# EasyEDA Pro project ProDoc_OHPP_003A_MIDI_B.epro, board OHPP-003-MIDI_B_2
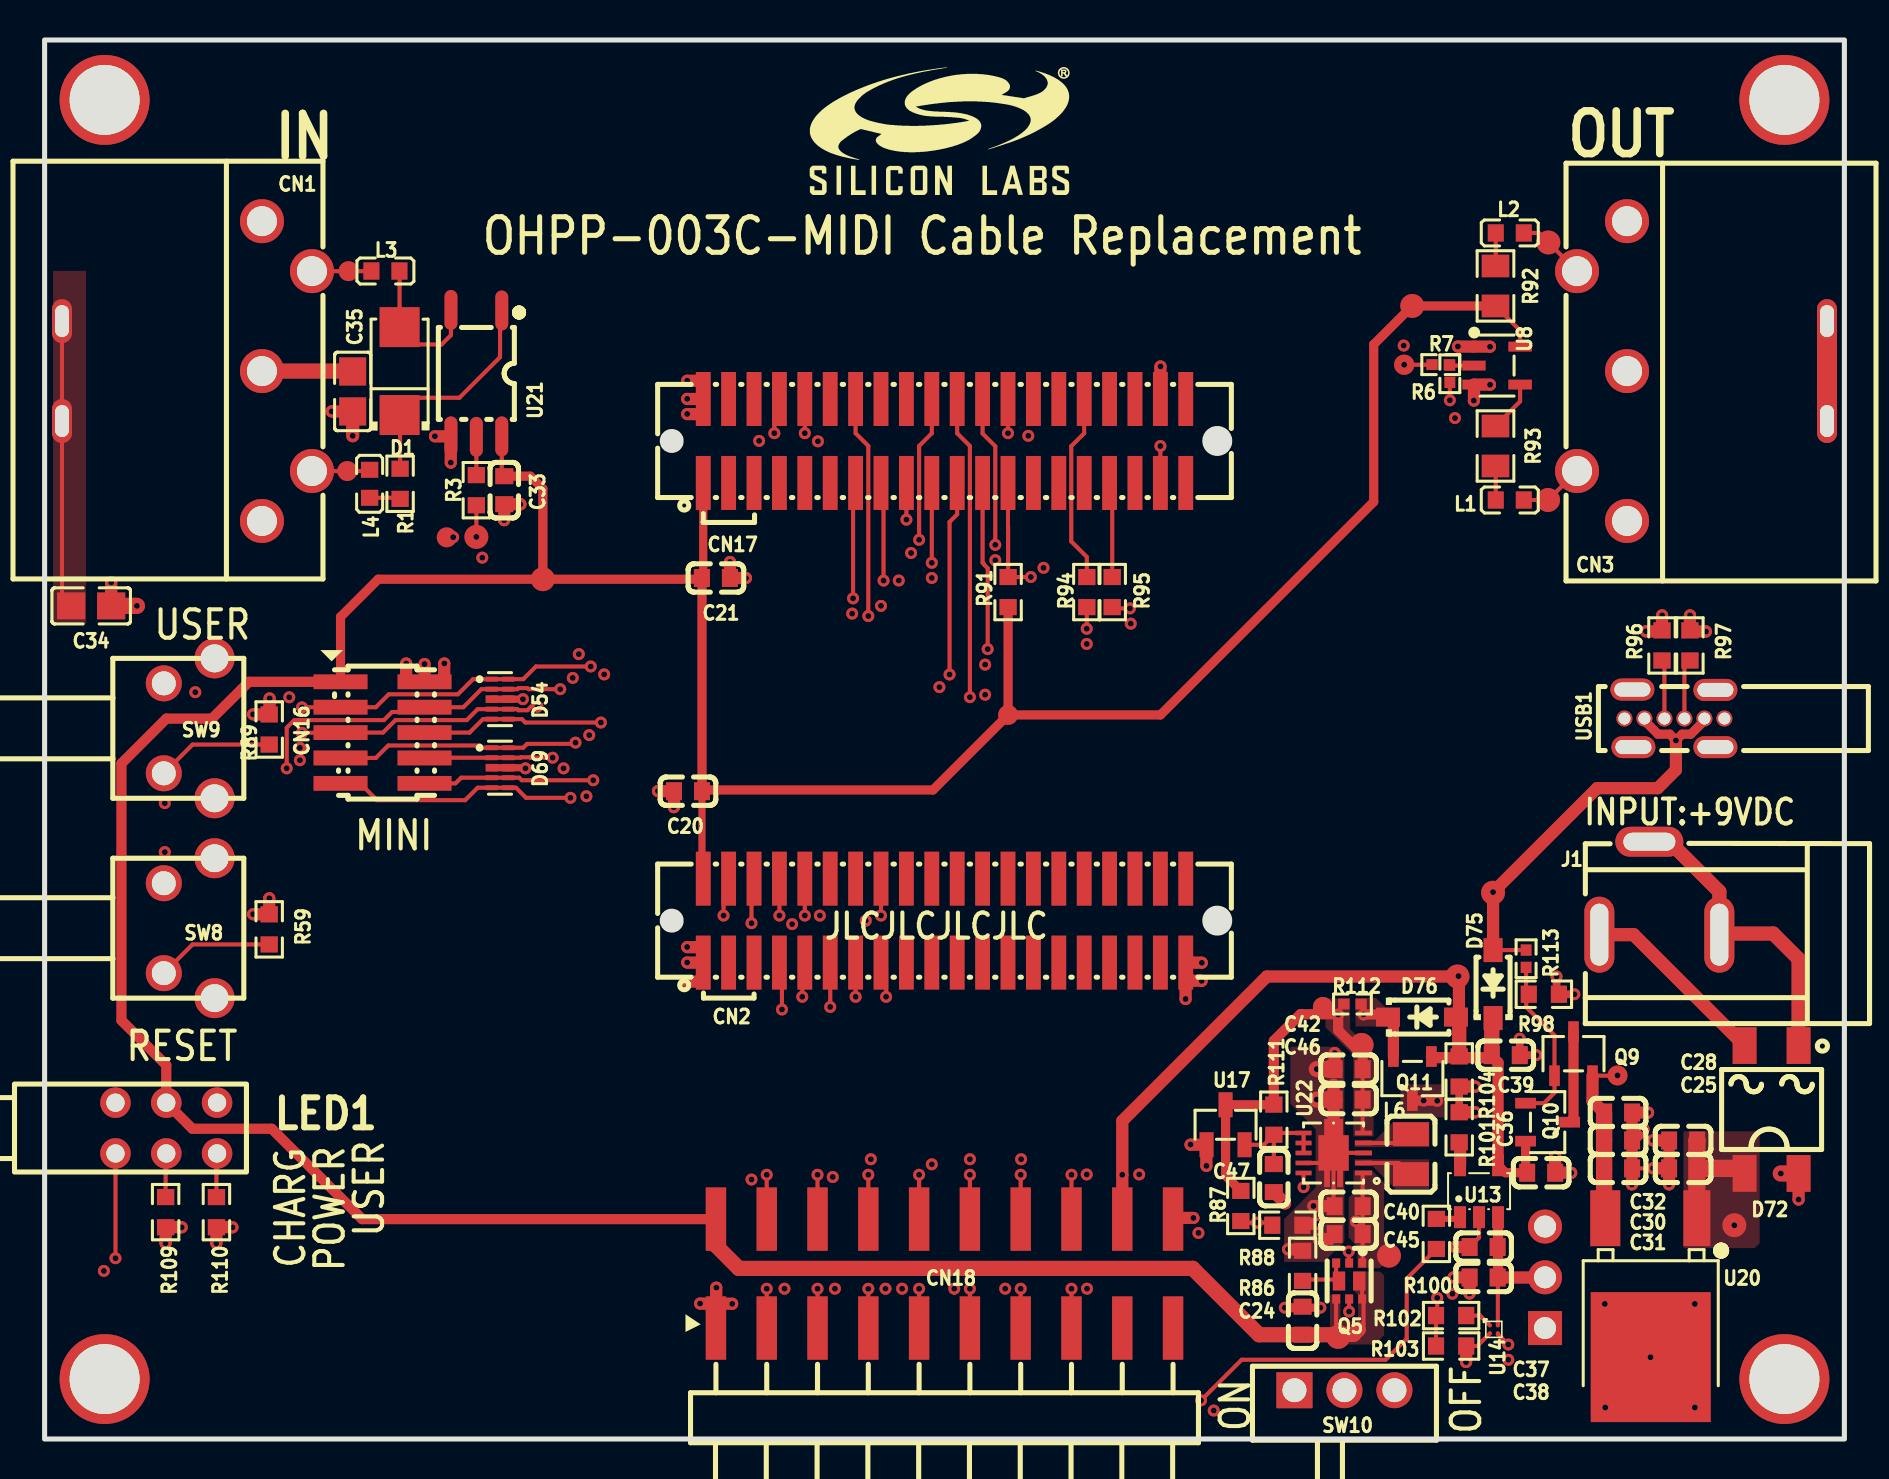
[diagram p2: board, top side]
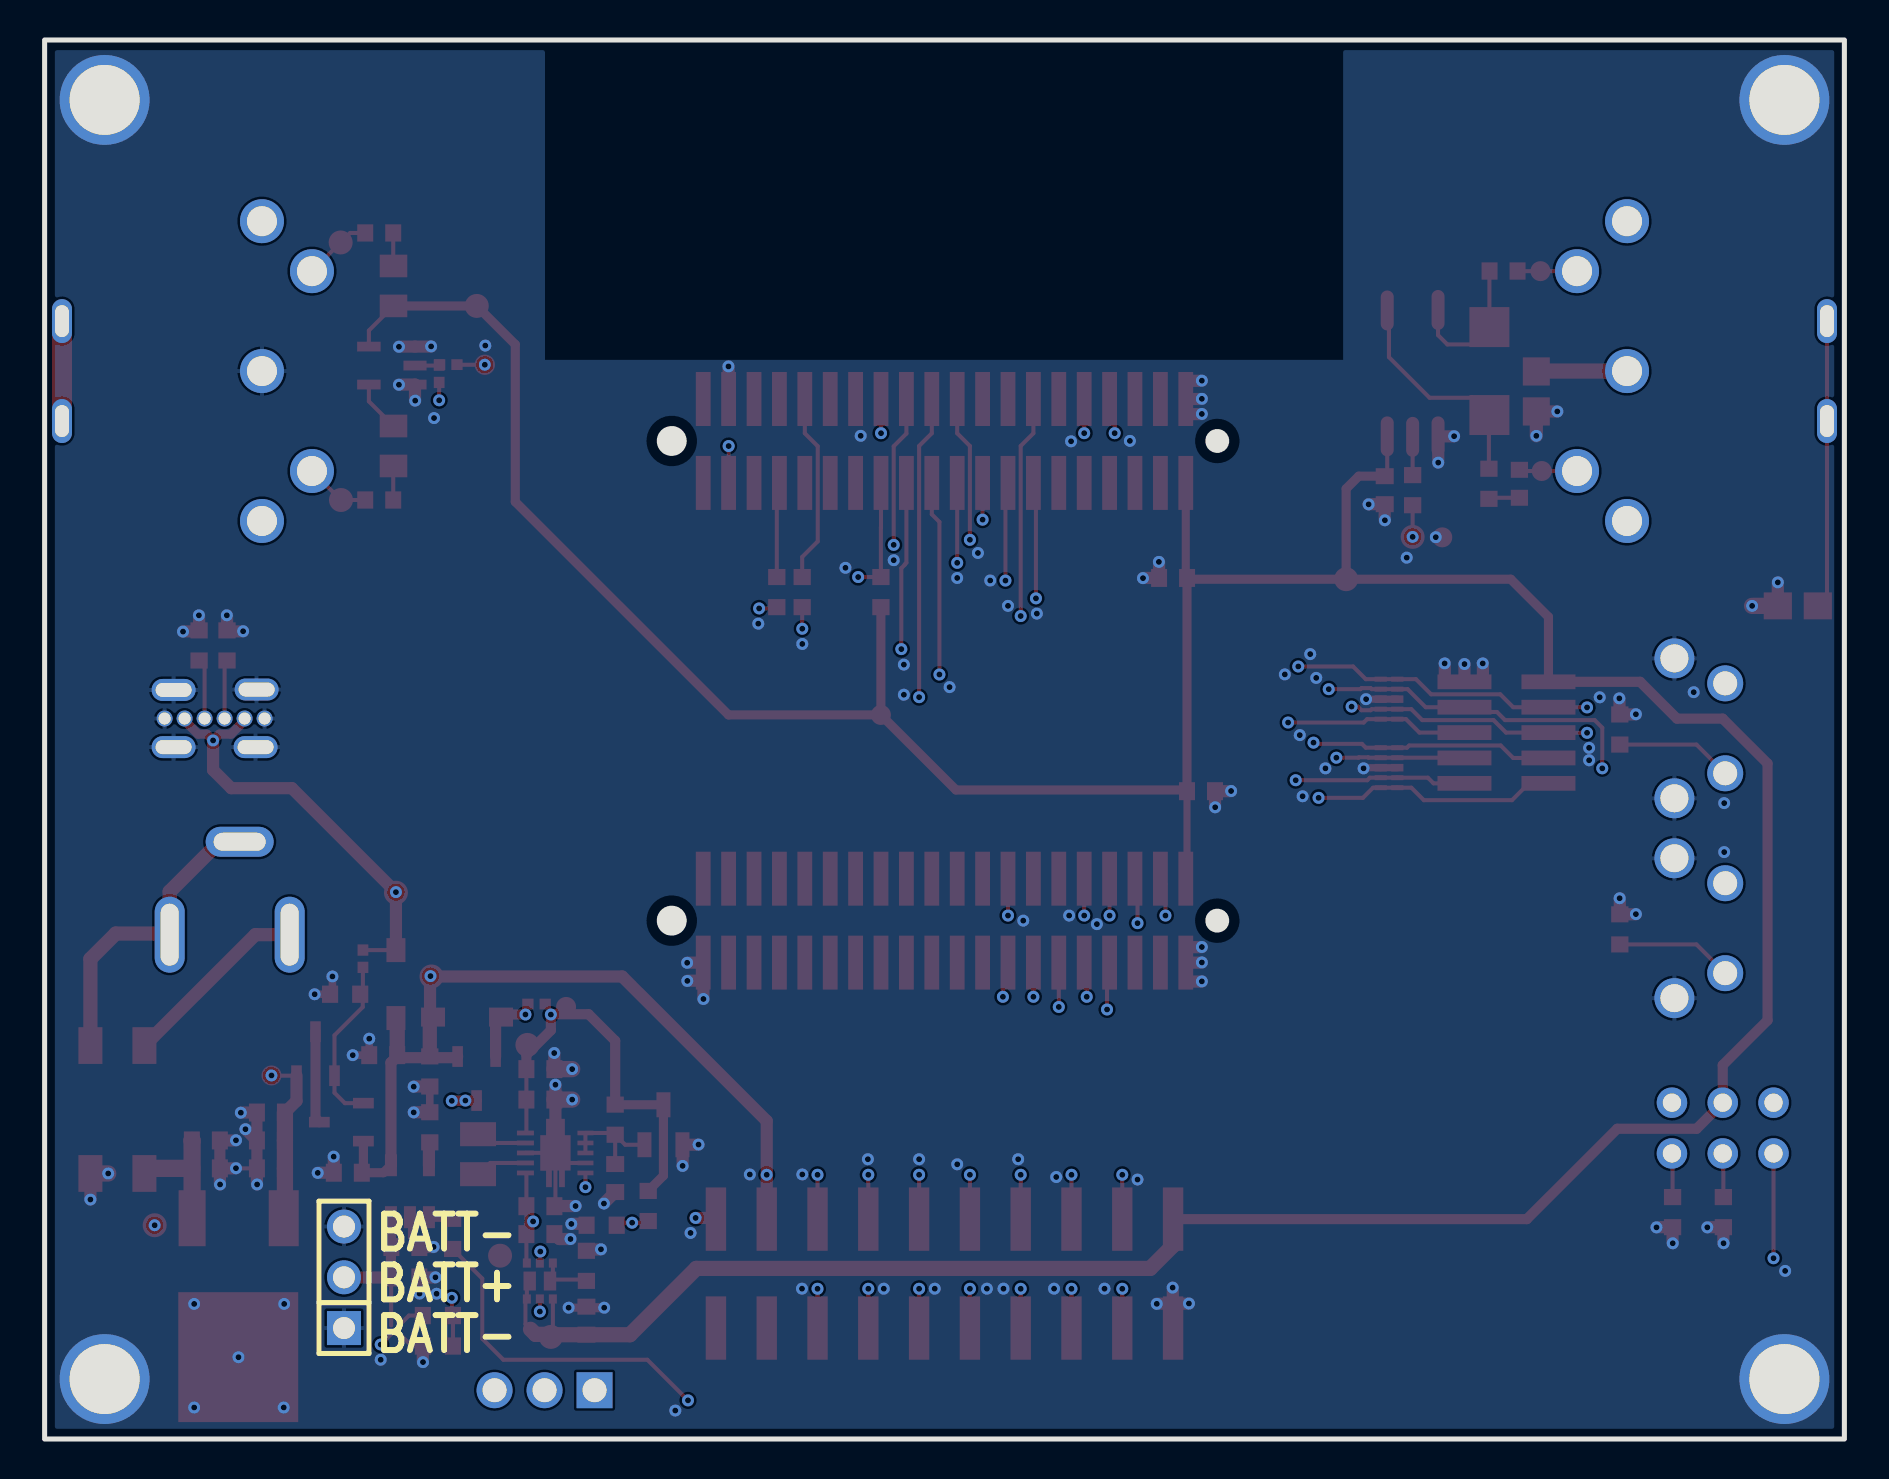
[diagram p3: board, bottom side, seen from below]

Outline 90 x 70 mm; copper layers: Top Layer, Inner1, Inner2, Bottom Layer. Coordinates in mm from the lower left corner of the outline.
Outline path: rectangle 0,70 90,0
Stack: Top Layer 0.035mm Outer layer thickness 1oz / Dielectric1 0.2104mm 7628 RC49% 8.6mil / Inner1 0.0152mm Inner layer thickness / Dielectric2 1.065mm 1.1mm H/HOZ Copper / Inner2 0.0152mm Inner layer thickness / Dielectric3 0.2104mm 7628 RC49% 8.6mil / Bottom Layer 0.035mm Outer layer thickness 1oz

## Design rules (mm)
template: Custom Config
spacing copperThickness1oz (default): track to track 0.102, other pairs 0.127 to 0.508
spacing copperThickness2oz: track to track 0.203, other pairs 0.203 to 0.203
track width copperThickness1oz (default): min 0.203, default 0.203, max 2.54
track width copperThickness2oz: min 0.203, default 0.508, max 2.54
differential pair differentialPair (default): width min 0.127, default 0.254, max 2.54; gap min 0.152, default 0.152
via viaSize (default): diameter min 0.45, default 0.599, max 1.801; hole min 0.201, default 0.3, max 1.001

## Placement (name value [footprint] x y rotation side)
C20  100nF  [C0603]  32.17 32.41 0 top
C21  100nF  [C0603]  33.57 43.08 180 top
C24  1uF  [C0603]  62.91 5.92 270 top
C25  10uF  [C0603]  81.94 13.54 0 top
C28  100nF  [C0603]  81.94 14.94 0 top
C30  10uF  [C0603]  78.68 14.94 180 top
C31  10uF  [C0603]  78.68 13.54 180 top
C32  100nF  [C0603]  78.68 16.34 180 top
C33  100nF  [C0603]  22.99 47.47 90 top
C34  100nF  [C0805]  2.33 41.68 180 top
C35  100nF  [C0805]  15.41 52.41 90 top
C36  10uF  [C0603]  74.84 13.32 180 top
C37  10uF  [C0603]  71.96 9.61 0 top
C38  100nF  [C0603]  71.96 8.08 0 top
C39  100nF  [C0603]  73.07 19.21 180 top
C40  10uF  [C0603]  65.21 11.65 0 top
C42  10uF  [C0603]  65.21 18.51 0 top
C45  10uF  [C0603]  65.21 10.25 0 top
C46  10uF  [C0603]  65.21 16.98 0 top
C47  100nF  [C0603]  61.47 13.06 270 top
CN1  DIN-504D-M5  [CONN-TH_DIN-504D-M5]  7.12 53.43 270 top
CN2  3131-40MG0BK00T2  [CONN-SMD_40P-P1.27_WCON_3131-40MG0BK00T2]  45 25.94 180 top
CN3  DIN-504D-M5  [CONN-TH_DIN-504D-M5]  82.88 53.43 90 top
CN16  3132-10MG0BK00R2  [IDC-SMD_3132-10MG0BK00R2]  16.9 35.35 270 top
CN17  3131-40MG0BK00T2  [CONN-SMD_40P-P1.27_WCON_3131-40MG0BK00T2]  45 49.94 180 top
CN18  PZ254-2-10-WS  [HDR-SMD_20P-P2.54-H-M-R2-C10_L8.5]  45 8.28 0 top
D1  MBRA140T3G  [SMA_L4.3-W2.6-LS5.2-RD]  17.75 53.43 90 top
D54  TPD4E02B04DQAR  [USON-10_L2.5-W1.0-P0.50-BL]  22.77 37.02 270 top
D69  TPD4E02B04DQAR  [USON-10_L2.5-W1.0-P0.50-BL]  22.77 33.59 270 top
D72  KMB24F  [DIO-BG-SMD_MBF-TL]  86.36 16.49 270 top
D75  B5819W SL  [SOD-123_L2.7-W1.6-LS3.7-RD-1]  72.43 22.76 90 top
D76  B5819W SL  [SOD-123_L2.7-W1.6-LS3.7-RD-1]  68.88 21.11 0 top
H4  -  [HOLE_D3M5_D7M0_PAD_PTH]  3 67 0 top
H5  -  [HOLE_D3M5_D7M0_PAD_PTH]  3 3 0 top
H6  -  [HOLE_D3M5_D7M0_PAD_PTH]  87 3 0 top
H7  -  [HOLE_D3M5_D7M0_PAD_PTH]  87 67 0 top
H8  KH-2.54PH180-1X3P-L11.5  [HDR-TH_3P-P2.54-V-M]  75.03 8.09 90 bottom
J1  DC-005-20A  [DC-IN-TH_DC-005-20A]  80.75 27.56 180 top
L1  MMZ1608Y102BTD25  [L0603]  73.27 46.98 180 top
L2  MMZ1608Y102BTD25  [L0603]  73.27 60.34 180 top
L3  MMZ1608Y102BTD25  [L0603]  17.04 58.44 0 top
L4  MMZ1608Y102BTD25  [L0603]  16.25 47.79 270 top
L6  2.2uH  [L0806]  68.33 14.25 270 top
LED1  LH33K010F-HTS  [LED-TH_6P-L11.6-W4.4-P2.54_LH33K010F-HTS]  6.08 15.56 270 top
NOREF  -  [Pad_e987]  84.5 10.7 0 top
NOREF#2  -  [Pad_e986]  70.65 23.14 0 top
NOREF#3  -  [Pad_e1015]  15.13 48.43 0 top
NOREF#4  -  [Pad_e1002]  75.2 59.87 0 top
NOREF#5  -  [Pad_e727]  67.99 53.75 0 top
NOREF#6  -  [Pad_e998]  64.69 5.11 0 top
NOREF#7  -  [Pad_e991]  72.43 27.33 0 top
NOREF#8  -  [Pad_e1013]  20.11 45.11 0 top
NOREF#9  -  [Pad_e1008]  68.39 56.69 0 top
NOREF#10  -  [Pad_e999]  67.22 9.17 0 top
NOREF#11  -  [Pad_e1001]  75.18 46.98 0 top
NOREF#12  -  [Pad_e1025]  15.2 58.43 0 top
NOREF#13  -  [Pad_e984]  21.59 45.14 0 top
NOREF#14  -  [Pad_e982]  24.92 43.02 0 top
NOREF#15  -  [Pad_e997]  65.86 19.72 0 top
NOREF#16  -  [Pad_e1032]  63.92 21.62 0 top
NOREF#17  -  [Pad_e1031]  48.18 36.23 0 top
NOREF#18  -  [Pad_e988]  78.66 18.19 0 top
Q5  SIA527DJ-T1-GE3  [POWERPAK-SC-70-6_L2.0-W2.0-P0.65-BL]  65.23 7.91 180 top
Q9  SI2301CDS-T1-GE3  [SOT-23-3_L3.0-W1.7-P0.95-LS2.9-BR]  76.45 19.28 270 top
Q10  SI2301CDS-T1-GE3  [SOT-23-3_L3.0-W1.7-P0.95-LS2.9-BR]  75.16 15.85 180 top
Q11  SI2301CDS-T1-GE3  [SOT-23-3_L3.0-W1.7-P0.95-LS2.9-BR]  68.4 18.04 90 top
R1  220Ω  [R0603]  17.78 47.79 90 top
R3  150Ω  [R0603]  21.59 47.47 270 top
R6  0Ω  [R0402]  70.27 53.3 90 top
R7  0Ω  [R0402]  69.81 53.76 180 top
R59  120Ω  [R0603]  11.23 25.5 90 top
R86  470kΩ  [R0603]  62.91 8.66 270 top
R87  120Ω  [R0603]  59.82 11.66 90 top
R88  470kΩ  [R0603]  62.15 10.7 180 top
R89  120Ω  [R0603]  11.23 35.5 90 top
R91  10kΩ  [R0603]  48.18 42.38 270 top
R92  33Ω  [R0805]  72.55 57.69 270 top
R93  10Ω  [R0805]  72.55 49.69 90 top
R94  0Ω  [R0603]  52.12 42.38 270 top
R95  0Ω  [R0603]  53.39 42.38 90 top
R96  5.1kΩ  [R0603]  80.88 39.71 90 top
R97  5.1kΩ  [R0603]  82.28 39.71 90 top
R98  5.1kΩ  [R0603]  74.97 22.25 0 top
R100  510Ω  [R0603]  69.6 10.26 270 top
R101  2kΩ  [R0603]  70.74 15.6 90 top
R102  10kΩ  [R0603]  70.33 6.18 0 top
R103  10kΩ  [R0603]  70.33 4.65 180 top
R104  10kΩ  [R0603]  70.74 18.39 90 top
R109  510Ω  [R0603]  6.05 11.35 90 top
R110  510Ω  [R0603]  8.59 11.35 90 top
R111  100Ω  [R0603]  61.47 15.98 90 top
R112  0Ω  [R0402]  65.4 21.76 0 top
R113  0Ω  [R0402]  74.08 24.03 270 top
SW8  SKHHLQA010  [KEY-TH_4P-SKHHLQA010]  7.23 25.56 270 top
SW9  SKHHLQA010  [KEY-TH_4P-SKHHLQA010]  7.23 35.56 270 top
SW10  K3-1260D-L1  [SW-TH_K3-1260D-L1]  65 2.44 90 top
U8  SN74LVC1G125DBVR  [SOT-23-5_L3.0-W1.7-P0.95-LS2.8-BL]  72.63 53.71 270 top
U13  MCP73832T-2ACI/OT  [SOT-23-5_L3.0-W1.7-P0.95-LS2.8-BR]  71.73 12.4 270 top
U14  TPS22916CYFPR  [DSBGA-4_L0.8-W0.8-R2-C2-P0.40-BL]  72.47 5.49 270 top
U17  TPS3839G33DBZR  [SOT-23-3_L2.9-W1.3-P1.90-LS2.4-BR]  59.06 15.72 270 top
U20  L78M05ABDT-TR  [TO-252-2_L6.5-W6.1-P4.58-LS10.0-TL]  80.33 7.57 270 top
U21  TLP2361(V4-TPL,E  [OPTO-SMD-5_L3.7-W4.6-P1.27-LS7.0-BR]  21.59 53.32 90 top
U22  TPS63001DRCR  [VSON-10_L3.0-W3.0-P0.50-TL-EP_TPS62410DRCR]  64.46 14.31 180 top
USB1  TYPE-C 6P CC  [TYPE-C-TH_SHOUHAN_TYPE-C-6P-CC]  81.5 36.06 90 top

## Footprints (pads in the part's own frame, mm; a bottom-side part is the same pattern mirrored in y, then rotated)
C0603
  rect 0.8x0.9 smd: 1(-0.7,0) 2(0.7,0)
C0805
  rect 1.41x1.35 smd: 1(-1,0) 2(1,0)
CONN-SMD_40P-P1.27_WCON_3131-40MG0BK00T2
  rect 0.74x2.7 smd: 1(12.065,2.1) 2(12.065,-2.1) 3(10.795,2.1) 4(10.795,-2.1) 5(9.525,2.1) 6(9.525,-2.1) 7(8.255,2.1) 8(8.255,-2.1) 9(6.985,2.1) 10(6.985,-2.1) 11(5.715,2.1) 12(5.715,-2.1) 13(4.445,2.1) 14(4.445,-2.1) 15(3.175,2.1) 16(3.175,-2.1) 17(1.905,2.1) 18(1.905,-2.1) 19(0.635,2.1) 20(0.635,-2.1) 21(-0.635,2.1) 22(-0.635,-2.1) 23(-1.905,2.1) 24(-1.905,-2.1) 25(-3.175,2.1) 26(-3.175,-2.1) 27(-4.445,2.1) 28(-4.445,-2.1) 29(-5.715,2.1) 30(-5.715,-2.1) 31(-6.985,2.1) 32(-6.985,-2.1) 33(-8.255,2.1) 34(-8.255,-2.1) 35(-9.525,2.1) 36(-9.525,-2.1) 37(-10.795,2.1) 38(-10.795,-2.1) 39(-12.065,2.1) 40(-12.065,-2.1)
CONN-TH_DIN-504D-M5
  round 2.2 hole 1.5: 1(7.5,3.75) 2(0,3.75) 3(-7.5,3.75) 4(5,6.25) 5(-5,6.25)
  oval 2.2x1 hole 1.6x0.7: 6(-2.5,-6.25) 7(2.5,-6.25)
DC-IN-TH_DC-005-20A
  oval 1.5x3.8 hole 0.9x3.1: 1(3,2.325) 2(-3,2.325)
  oval 3.4x1.5 hole 2.6x0.9: 3(0.5,-2.325)
DIO-BG-SMD_MBF-TL
  rect 1.84x1.2 smd: 1(-3.2,1.35) 2(-3.2,-1.35) 3(3.2,-1.35) 4(3.2,1.35)
DSBGA-4_L0.8-W0.8-R2-C2-P0.40-BL
  round 0.18 smd: A1(-0.2,-0.2) A2(-0.2,0.2) B1(0.2,-0.2) B2(0.2,0.2)
HDR-SMD_20P-P2.54-H-M-R2-C10_L8.5
  rect 1.02x3.17 smd: 1(-11.43,-2.725) 2(-11.43,2.725) 3(-8.89,-2.725) 4(-8.89,2.725) 5(-6.35,-2.725) 6(-6.35,2.725) 7(-3.81,-2.725) 8(-3.81,2.725) 9(-1.27,-2.725) 10(-1.27,2.725) 11(1.27,-2.725) 12(1.27,2.725) 13(3.81,-2.725) 14(3.81,2.725) 15(6.35,-2.725) 16(6.35,2.725) 17(8.89,-2.725) 18(8.89,2.725) 19(11.43,-2.725) 20(11.43,2.725)
HDR-TH_3P-P2.54-V-M
  rect 1.7x1.7 hole 1.1: 1(-2.54,0)
  round 1.7 hole 1.1: 2(0,0) 3(2.54,0)
HOLE_D3M5_D7M0_PAD_PTH
  round 4.5 hole 3.5: 1(0,0)
IDC-SMD_3132-10MG0BK00R2
  rect 0.74x2.7 smd: 1(-2.54,-2.1) 2(-2.54,2.1) 3(-1.27,-2.1) 4(-1.27,2.1) 5(0,-2.1) 6(0,2.1) 7(1.27,-2.1) 8(1.27,2.1) 9(2.54,-2.1) 10(2.54,2.1)
KEY-TH_4P-SKHHLQA010
  round 1.8 hole 1.2: 1(-2.25,-1.27) 2(2.25,-1.27)
  round 2 hole 1.4: 3(3.5,1.27) 4(-3.5,1.27)
L0603
  rect 0.8x0.864 smd: 1(-0.7,0) 2(0.7,0)
L0806
  rect 1.2x1.8 smd: 1(-1,0) 2(1,0)
LED-TH_6P-L11.6-W4.4-P2.54_LH33K010F-HTS
  round 1.524 hole 0.914: 1(-1.27,-2.54) 2(1.27,-2.54) 3(-1.27,0) 4(1.27,0) 5(-1.27,2.54) 6(1.27,2.54)
OPTO-SMD-5_L3.7-W4.6-P1.27-LS7.0-BR
  oval 2x0.65 smd: 1(3.15,-1.27) 3(3.175,1.27) 4(-3.15,1.27) 5(-3.175,0) 6(-3.15,-1.27)
Pad_e727
  round 1.016 smd: 1(0,0)
Pad_e982
  round 1.2 smd: 1(0,0)
Pad_e984
  round 1.2 smd: 1(0,0)
Pad_e986
  round 1.2 smd: 1(0,0)
Pad_e987
  round 1.2 smd: 2(0,0)
Pad_e988
  round 1 smd: 3(0,0)
Pad_e991
  round 1.2 smd: 4(0,0)
Pad_e997
  round 1.2 smd: 5(0,0)
Pad_e998
  round 1.2 smd: 6(0,0)
Pad_e999
  round 1.2 smd: 7(0,0)
Pad_e1001
  round 1.2 smd: 1(0,0)
Pad_e1002
  round 1.2 smd: 2(0,0)
Pad_e1008
  round 1.2 smd: 3(0,0)
Pad_e1013
  round 1 smd: 1(0,0)
Pad_e1015
  round 1 smd: 1(0,0)
Pad_e1025
  round 1 smd: 2(0,0)
Pad_e1031
  round 1 smd: 3(0,0)
Pad_e1032
  round 1 smd: 4(0,0)
POWERPAK-SC-70-6_L2.0-W2.0-P0.65-BL
  rect 0.4x0.46 smd: 1(-0.65,-0.9) 2(0,-0.9) 3(0.65,-0.9) 4(0.65,0.9) 5(0,0.9) 6(-0.65,0.9)
  rect 0.62x0.95 smd: 7(0.508,0) 8(-0.508,0)
R0402
  rect 0.566x0.54 smd: 1(-0.433,0) 2(0.433,0)
R0603
  rect 0.806x0.864 smd: 1(-0.753,0) 2(0.753,0)
R0805
  rect 1.133x1.377 smd: 1(-1,0) 2(1,0)
SMA_L4.3-W2.6-LS5.2-RD
  rect 2x2 smd: 1(-2.2,0) 2(2.2,0)
SOD-123_L2.7-W1.6-LS3.7-RD-1
  rect 1.2x0.95 smd: 1(-1.7,0) 2(1.7,0)
SOT-23-3_L2.9-W1.3-P1.90-LS2.4-BR
  rect 1.25x0.7 smd: 1(1,-0.95) 2(1,0.95) 3(-1,0)
SOT-23-3_L3.0-W1.7-P0.95-LS2.9-BR
  rect 1.038x0.532 smd: 1(1.101,-0.95) 2(1.101,0.95) 3(-1.101,0)
SOT-23-5_L3.0-W1.7-P0.95-LS2.8-BL
  rect 0.49x1.157 smd: 1(-0.95,-1.153) 2(0,-1.153) 3(0.95,-1.153)
  rect 0.49x1.175 smd: 4(0.95,1.153) 5(-0.95,1.153)
SOT-23-5_L3.0-W1.7-P0.95-LS2.8-BR
  rect 1.1x0.6 smd: 1(1.3,-0.95) 2(1.3,0) 3(1.3,0.95) 4(-1.3,0.95) 5(-1.3,-0.95)
SW-TH_K3-1260D-L1
  rect 1.8x1.8 hole 1.2: 1(0,2.5)
  round 1.8 hole 1.2: 2(0,0) 3(0,-2.5)
TO-252-2_L6.5-W6.1-P4.58-LS10.0-TL
  rect 2.8x1.35 smd: 1(-3.475,2.29)
  rect 2.8x1.5 smd: 3(-3.475,-2.29)
  rect 6.5x6 smd: 4(3.475,-0.017)
TYPE-C-TH_SHOUHAN_TYPE-C-6P-CC
  oval 1.1x2.2 hole 0.7x1.8: 7(-1.44,2.05) 7(-1.44,-2.05) 7(1.42,-2.05) 7(1.44,2.1)
  round 0.8 hole 0.6: A5(-0.01,-0.5) A9(-0.01,1.5) A12(-0.01,2.5) B5(-0.01,0.5) B9(-0.01,-1.5) B12(-0.01,-2.5)
USON-10_L2.5-W1.0-P0.50-BL
  rect 0.25x0.609 smd: 1(-1,-0.414) 2(-0.5,-0.414) 4(0.5,-0.414) 5(1,-0.414) 6(1,0.414) 7(0.5,0.414) 9(-0.5,0.414) 10(-1,0.414)
  rect 0.38x0.609 smd: 3(0,-0.414) 8(0,0.414)
VSON-10_L3.0-W3.0-P0.50-TL-EP_TPS62410DRCR
  rect 0.85x0.24 smd: 1(-1.5,1) 2(-1.5,0.5) 3(-1.5,0) 4(-1.5,-0.5) 5(-1.5,-1)
  rect 0.8x0.23 smd: 6(1.5,-1) 7(1.5,-0.5) 8(1.5,0) 9(1.5,0.5) 10(1.5,1)
  custom 1.52x3.42 smd: 11(0,-0.005)

## Nets
As in the schematic, except:
+3.3V_EFR: C20.2 C21.2 C24.2 C33.2 CN2.2 CN16.1 CN17.1 CN18.2 LED1.3 NOREF#6.6 NOREF#9.3 NOREF#14.1 NOREF#17.3 Q5.4 Q5.6 Q5.8 R91.2 R92.2 U8.5 U21.6
+3V3_BUCK_BOOST: C40.2 C45.2 CN18.20 NOREF#10.7 Q5.1 U22.1 U22.10
+5V: C36.2 C39.2 CN17.37 CN18.18 D75.1 D76.2 LED1.1 NOREF#2.1 Q10.2 Q11.1 R104.2 U13.4
+5V_1: C30.2 C31.2 C32.2 NOREF#18.3 Q9.2 U20.3
+5V_2: D75.2 NOREF#7.4 R113.1 USB1.A9 USB1.B9
+8.3V: C25.2 C28.2 D72.3 NOREF.2 U20.1
+VCC1: C42.2 C46.2 NOREF#15.5 NOREF#16.4 R87.2 R111.2 R112.1 SW10.1 U17.3 U22.5
GND: C20.1 C21.1 C24.1 C25.1 C28.1 C30.1 C31.1 C32.1 C33.1 C34.1 C35.1 C36.1 C37.1 C38.1 C39.1 C40.1 C42.1 C45.1 C46.1 C47.2 CN2.1 CN2.39 CN3.2 CN16.2 CN17.2 CN17.38 CN18.1 D54.3 D54.8 D69.3 D69.8 D72.4 H4.1 H5.1 H6.1 H7.1 H8.1 H8.3 NOREF#8.1 R59.2 R86.1 R88.1 R89.2 R96.2 R97.2 R98.2 R101.2 R103.1 R104.1 R109.1 R110.1 SW8.3 SW8.4 SW9.3 SW9.4 U8.1 U8.3 U13.2 U14.B1 U17.1 U20.4 U21.4 U22.3 U22.9 U22.11 USB1.7 USB1.A12 USB1.B12
WSTK_P41: CN17.8 NOREF#5.1 R7.2
WSTK_P43: CN17.10 NOREF#13.1 R3.2 R6.1
$2N1277: CN3.5 L1.1 NOREF#11.1
$2N12552: CN1.5 L3.1 NOREF#12.2
$2N12593: CN1.4 L4.1 NOREF#3.1
$2N15542: CN3.4 L2.1 NOREF#4.2

Pads without a net: CN1 1 3; CN2 3 5 12 14 17 18 19 20 21 22 23 24 25 26 27 28 29 30 31 32 33 34 35 36 37 38 40; CN3 1 3; CN17 3 4 5 6 7 9 11 12 27 28 29 30 31 34 35 36 39 40; CN18 17 19; SW10 3

## Via types
v1: diameter 0.6, hole 0.299, Top Layer to Bottom Layer, 213 vias

## Routing (per net, layer and track width the routed paths; a pad name or vN(x,y) marks a point on that pad's centre or on a via; arc(x,y) is an arc through that point)
+3.3V_EFR: length 213.8
  Top Layer w0.203: U21.6 22.86,48.3 C33.2 ; Q5.8 65.88,7.76 Q5.6 65.96,6.94 65.96,5.74 65.7,5.49 ; 73.78,54.66 73.78,55.46 R92.2 ; 64.83,5.09 64.58,5.34 Q5.4
  Top Layer w0.355: 32.87,32.15 32.87,28.1 CN2.2
  Top Layer w0.406: 32.94,43.02 CN17.1
  Top Layer w0.457: 32.87,43.02 32.87,32.15 ; 32.87,43.02 32.87,43.02 ; 32.87,43.02 32.94,43.02 ; CN16.1 14.8,41.13 16.68,43.02 NOREF#14.1 ; NOREF#17.3 44.43,32.48 32.94,32.48 ; NOREF#17.3 R91.2 ; NOREF#17.3 55.8,36.23 66.46,46.89 66.46,54.77 NOREF#9.3 R92.2 ; NOREF#14.1 24.92,47.55 24.29,48.17 C33.2 ; NOREF#14.1 32.87,43.02 ; 32.87,43.02 C21.2 ; CN2.2 32.94,27.77
  Top Layer w0.508: CN16.1 10.21,37.89 8.37,36.04 6.09,36.04 3.84,33.8 3.84,20.95 6.08,18.71 LED1.3 7.39,15.52 11.36,15.52 15.88,11 33.57,11
  Top Layer w0.762: 33.57,11 33.57,9.68 34.71,8.54 57.41,8.54 60.73,5.22 64.67,5.22 64.69,5.24 65.45,5.24 65.7,5.49
+3V3_BUCK_BOOST: length 16.7
  Top Layer w0.203: v1(65.57,10.89) 65.65,10.81 65.91,10.81 ; 65.91,10.81 C45.2 ; 65.91,10.81 C40.2 65.91,13.27 U22.1 ; 65.91,10.81 65.93,10.79 65.93,10.23 C45.2 ; C45.2 65.91,8.83 Q5.1 ; U22.10 v1(62.96,12.6)
  Top Layer w0.61: v1(57.45,11.06) 56.49,11.06 56.43,11
  Inner2 w0.559: v1(57.45,11.06) 58.99,12.6 v1(62.96,12.6)
  Inner2 w0.61: v1(65.57,10.89) 63.86,12.6 v1(62.96,12.6)
+5V: length 145.5
  Top Layer w0.203: 55.8,47.84 v1(55.8,49.68)
  Top Layer w0.457: U13.4 73.06,13.32 C36.2 74.06,13.4 Q10.2
  Top Layer w0.559: Q11.1 69.41,19.08 72.43,19.08 72.68,18.83 U13.4
  Top Layer w0.61: 70.73,23.14 v1(70.71,23.16) ; 70.73,23.14 61.12,23.14 53.89,15.91 v1(53.89,13.22) 53.89,11 ; 70.73,23.14 70.73,21.31 70.65,21.24
  Top Layer w0.711: D76.2 70.74,20.95 R104.2
  Top Layer w0.762: D75.1 72.37,21 C39.2
  Inner2 w0.406: v1(53.89,13.22) 53.89,6.63 50.59,3.33 10.84,3.33 2.33,11.84 2.33,15.61 LED1.1
  Inner2 w0.508: v1(55.8,49.68) 70.71,34.77 v1(70.71,23.16)
+5V_1: length 8.7
  Top Layer w0.203: Q9.2 78.64,18.18 v1(78.66,18.19)
  Top Layer w0.61: C32.2 77.4,16.91 Q9.2
  Top Layer w0.813: U20.3 77.98,11.11 C31.2 C30.2 C32.2
+5V_2: length 21.7
  Top Layer w0.203: D75.2 74.08,24.46 74.08,24.46
  Top Layer w0.457: USB1.B9 83,35.94 82.32,35.27 81.89,35.27 v1(81.58,34.95) 81.26,35.27 80.68,35.27 80,35.94 USB1.A9
  Top Layer w0.61: v1(81.58,34.95) 81.58,33.47 80.67,32.56 77.63,32.56 v1(72.43,27.36) D75.2
+8.3V: length 6.4
  Top Layer w0.864: U20.1 82.62,14.93 C28.2 ; C25.2 84.75,13.54 D72.3
  vias: v1(84.5,10.7)
+9V: length 9.6
  Top Layer w0.66: D72.2 79.46,25.23 J1.1
+VBAT: length 20.1
  Top Layer w0.203: C38.2 72.67,8.07 U14.A2
  Top Layer w0.508: v1(69.64,16.92) 69.62,16.93 v1(68.96,16.93) Q11.3 ; U13.3 72.68,8.1 C38.2
  Top Layer w0.61: C38.2 75.02,8.08 H8.2
  Inner2 w0.864: v1(69.64,16.92) 71.54,15.02 71.54,11.58 H8.2
+VCC: length 24.3
  Top Layer w0.508: 67.21,21.24 v1(65.96,21.24)
  Top Layer w0.559: 67.21,21.24 67.45,21 Q11.2
  Inner2 w0.61: 64.69,2.44 67.73,5.49 67.73,11.97 66.41,13.29 66.41,20.7 65.96,21.15 v1(65.96,21.24)
+VCC1: length 42.8
  Top Layer w0.203: C42.2 C46.2 65.91,15.36 U22.5
  Top Layer w0.457: R111.2 61.46,16.72 U17.3 59.06,13.18 R87.2
  Top Layer w0.508: R111.2 61.47,19.93 62.8,21.25 64.67,21.25 v1(64.69,21.24) 64.69,20.45 65.91,19.23 C42.2
  Inner2 w0.66: v1(64.69,21.24) 64.69,20.73 65.35,20.07 65.35,12.58 66.59,11.33 66.59,6.12 64.94,4.47 63.28,4.47 62.53,3.72 62.53,2.78 62.19,2.44
-9V: length 15.5
  Top Layer w0.711: 83.75,25.29 J1.2 ; 83.75,25.29 86.44,25.29 87.71,24.02 D72.1 ; 83.75,25.29 83.75,27.39 81.25,29.88 J1.3
GND: length 88.5
  Top Layer w0.203: U22.3 65.95,14.32 64.46,14.32 ; 64.46,14.32 63.95,13.81 U22.9 ; 64.46,14.32 64.46,11.7 ; C37.1 71.73,10.08 U13.2 ; 61.47,12.16 C47.2 ; R103.1 71.64,4.65 U14.B1 ; 33.57,6.28 CN18.1 ; C31.1 80.44,13.54
  Top Layer w0.355: D54.3 D54.8 v1(23.92,37.02) ; D69.3 D69.8 24.01,33.59 v1(24.05,33.56)
  Top Layer w0.381: R101.2 R104.1 ; v1(76.5,22.25) 75.62,22.25 75.61,22.26 v1(75.61,23.14) ; v1(74.59,19.21) C39.1 v1(73.77,20.03)
  Top Layer w0.406: 62.91,6.57 v1(63.8,6.57)
  Top Layer w0.457: 62.91,6.57 v1(62.02,6.57)
  Top Layer w0.559: C25.1 C28.1 ; C31.1 C30.1 C32.1
  Top Layer w0.61: v1(64.46,17.73) 64.46,14.32 ; v1(23.79,46.77) 23.78,46.77 C33.1 22.99,45.98 ; v1(20.31,48.85) 20.31,50.16 U21.4 19.53,50.17 ; 83.07,40.41 82.28,40.41 82.28,41.2 ; 32.14,52.94 32.94,52.94 ; 72.27,52.76 U8.3 71.48,51.96 ; 57.31,14.72 U17.1 58.1,14.71 v1(58.1,13.67) ; 11.25,37.05 11.25,36.25 ; v1(70.55,9.61) 70.55,9.61 C37.1 ; v1(63.45,11.66) 64.5,11.66 C40.1 ; 64.51,19.3 C42.1 ; v1(87.71,11.98) D72.4 ; 80.88,41.2 80.88,40.41 80.08,40.41 ; 80.44,13.54 C25.1 81.24,12.75 ; 6.85,10.6 R109.1 6.05,9.8 ; 32.14,23.84 CN2.1 ; 32.14,51.28 32.94,51.28 ; 18.08,38.8 18.08,38 ; 71.53,16.35 R101.2 ; 79.94,15.5 C30.1 ; v1(3.33,42.86) C34.1 ; 10.44,26.25 R59.2 11.23,27.05 ; v1(57.06,22.02) 57.06,22.93 ; 57.06,22.93 57.85,22.93 ; 57.06,22.93 57.06,23.83 CN2.39 57.86,23.84 ; 32.14,22.89 32.94,22.89 ; v1(19,38.77) CN16.2 ; 9.39,10.6 R110.1 8.59,9.8 ; 32.14,24.61 32.94,24.61 ; 55.8,53.66 55.8,52.86 ; 31.47,31.62 C20.1 30.68,32.41 ; 63.65,10.77 62.86,10.77 ; 79.38,12.75 C31.1 ; 71.09,3.86 R103.1 ; 70.68,54.66 U8.1 72.27,54.66 ; 76.33,13.32 C36.1 75.54,14.12 ; 62.19,9.48 62.98,9.48 ; 34.27,43.88 C21.1 35.06,43.08 ; 80.44,14.94 C28.1 ; 71.53,17.64 R104.1 ; 33.58,6.77 34.38,6.77 ; 33.58,6.77 33.58,7.57 ; 33.58,6.77 32.79,6.77 ; 70.46,8.08 C38.1 71.26,7.29 ; 19.98,38.8 19.98,38 ; R89.2 10.44,36.25 ; v1(14.36,51.41) C35.1 ; 62.03,11.79 C47.2 ; 80.18,16.34 C32.1 ; 32.14,52.04 CN17.2 ; v1(63.7,10.01) 64.26,10.01 C45.1
  Top Layer w0.66: C35.1 v1(15.41,50.19)
  Top Layer w0.813: D72.4 v1(86.82,13.29) ; C42.1 v1(63.62,18.51) ; v1(63.62,16.98) C46.1 ; 33.58,6.26 33.57,6.28 ; C34.1 v1(4.61,41.68)
  vias: v1(2.96,8.41) v1(6.01,31.82) v1(6.01,29.37) v1(6.04,9.8) v1(6.86,10.59) v1(7.54,37.37) v1(8.58,9.8) v1(9.4,10.59) v1(10.43,36.26) v1(10.43,26.26) v1(11.26,37.06) v1(11.24,27.06) v1(12.23,37.11) v1(12.77,34.58) v1(12.77,33.96) v1(18.09,38.81) v1(19.52,50.17) v1(19.99,38.81) v1(20.43,45.12) v1(21.89,44.1) v1(22.98,45.97) v1(25.95,33.56) v1(26.41,38.08) v1(26.71,39.27) v1(27.09,32.16) v1(27.23,35.22) v1(27.98,38.26) v1(30.67,32.42) v1(31.46,31.61) v1(32.13,52.95) v1(32.13,52.05) v1(32.13,51.29) v1(32.13,24.62) v1(32.13,23.85) v1(32.13,22.9) v1(32.78,6.78) v1(33.59,7.58) v1(34.28,43.89) v1(34.39,6.76) v1(35.07,43.07) v1(35.35,12.98) v1(35.73,49.94) v1(37,7.52) v1(37.38,25.76) v1(38.67,49.92) v1(38.77,26.19) v1(39.41,13.11) v1(39.52,7.52) v1(40.38,41.3) v1(41.06,25.94) v1(41.32,14) v1(41.83,41.68) v1(42.05,7.52) v1(42.71,42.95) v1(42.88,7.52) v1(43.33,44.33) v1(44.37,43.08) v1(44.37,13.74) v1(44.75,37.62) v1(45.49,7.52) v1(46.27,14) v1(47.03,38.75) v1(47.03,37.24) v1(47.54,43.97) v1(48.04,7.52) v1(48.83,14) v1(49.19,50.19) v1(49.95,43.59) v1(52.11,39.78) v1(52.11,13.24) v1(52.13,7.52) v1(54.31,40.8) v1(54.74,13.24) v1(55.8,53.66) v1(57.3,14.73) v1(57.7,10.31) v1(57.87,23.83) v1(57.86,22.92) v1(58.46,1.43) v1(62.03,11.78) v1(62.18,9.49) v1(63.66,10.76) v1(64.52,19.31) v1(67.96,54.71) v1(70.46,8.09) v1(70.4,7.27) v1(70.53,51.08) v1(70.67,54.67) v1(71.08,3.85) v1(71.25,7.28) v1(71.47,51.95) v1(71.54,17.63) v1(71.54,16.34) v1(72.28,54.65) v1(72.28,52.75) v1(73.19,3.97) v1(75.55,14.13) v1(76.34,13.32) v1(78.02,6.76) v1(78.04,1.58) v1(79.37,12.74) v1(79.96,15.5) v1(80.07,40.42) v1(80.19,16.33) v1(80.31,4.09) v1(80.43,14.95) v1(80.43,13.55) v1(80.89,41.21) v1(81.23,12.74) v1(82.28,41.21) v1(82.52,6.76) v1(82.52,1.58) v1(83.08,40.4)
PGND: length 5
  Top Layer w1: CN3.7 CN3.6
AN: length 11.3
  Top Layer w0.203: U21.1 22.78,56.38 22.78,54.13 20.74,52.1 18.62,52.1 D1.1 17.78,51.21 R1.2
CAT: length 7.2
  Top Layer w0.203: 20.32,56.49 20.32,55.23 19.85,54.77 18.62,54.77 D1.2 17.75,58.43 L3.2
CTRL1: length 8.5
  Top Layer w0.203: R113.2 74.08,22.26 74.09,22.25 74.09,21.61 75.5,20.2 Q9.1 75.5,17.32 74.98,16.8 Q10.1
CTRL2: length 11.1
  Top Layer w0.203: Q5.2 65.22,8.82 65.22,9.37 v1(65.21,9.38) ; 61.39,10.74 61.31,10.82 v1(60.62,10.82) 59.9,10.82 R87.1 ; Q5.5 v1(65.23,6.38)
  Inner2 w0.203: v1(65.23,6.38) 65.21,6.4 v1(65.21,9.38) 63.46,9.38 62.02,10.82 v1(60.62,10.82)
RADIO_F0: length 35.1
  Top Layer w0.203: CN17.13 40.43,47.71 v1(40.43,42.06) ; CN16.7 16.56,34.08 17.19,34.7 21.76,34.7 21.87,34.59 D69.1 D69.10 23.93,34.59 24.13,34.78 26.49,34.78 v1(26.55,34.84)
  Inner2 w0.203: v1(26.55,34.84) 26.82,34.57 31.41,34.57 38.9,42.07 40.42,42.07 v1(40.43,42.06)
RADIO_F1: length 36.5
  Top Layer w0.203: CN16.8 19.01,34.09 D69.2 D69.9 23.79,34.09 23.82,34.11 24.27,34.11 24.3,34.09 v1(25.4,34.09) ; v1(41.19,41.18) 41.19,49.69 40.56,50.32 CN17.14
  Inner2 w0.203: v1(25.4,34.09) 25.7,34.09 25.72,34.11 26.18,34.11 26.48,33.81 32.55,33.81 39.16,40.41 40.43,40.41 v1(41.19,41.18)
RADIO_F2: length 31.2
  Top Layer w0.203: CN17.15 41.95,47.71 v1(41.95,42.95) ; CN16.6 21.25,35.35 21.92,36.02 D54.5 D54.6 23.87,36.02 24.04,35.85 v1(27.82,35.85)
  Inner2 w0.203: v1(41.95,42.95) 37.73,42.95 30.63,35.85 v1(27.82,35.85)
RADIO_F4: length 50.2
  Top Layer w0.203: CN17.17 v1(43.09,46) ; v1(27.31,38.65) 24.57,38.65 23.93,38.02 D54.10 D54.1 21.42,38.02 20.67,37.26 17.21,37.26 16.56,36.62 CN16.3 12.88,36.62 v1(12.87,36.6)
  Inner2 w0.203: v1(27.31,38.65) 27.36,38.65 34.71,46 v1(43.09,46) ; v1(12.87,36.6) 10.84,34.57 10.84,28.98 9.19,27.33 7.66,27.33 7.19,27.81 SW8.1
RADIO_F6: length 118
  Top Layer w0.203: v1(24.64,36.64) 24.33,36.64 24.15,36.46 23.69,36.46 23.64,36.52 D54.7 D54.4 21.66,36.52 21.11,35.97 17.54,35.97 16.92,35.35 CN16.5 14.79,35.33 v1(12.87,35.33) ; 46.27,11 v1(46.27,13.22) ; CN17.19 v1(44.37,43.84)
  Inner2 w0.203: v1(44.37,43.84) 44.3,43.78 36.68,43.78 29.55,36.64 v1(24.64,36.64) ; v1(46.27,13.22) 46.27,10.44 47.29,9.43 47.29,7.01 46.14,5.87 14.9,5.87 7.41,13.36 7.41,17.81 8.04,18.44 10.33,18.44 14.14,22.25 14.14,34.06 v1(12.87,35.33)
RADIO_F7: length 130.5
  Top Layer w0.203: v1(43.73,44.99) 43.73,49.69 44.37,50.32 CN17.20 ; 48.81,11 v1(48.81,13.22) ; 25.75,37.52 v1(25.79,37.52) ; v1(12.11,33.56) 12.11,35.59 12.49,35.97 16.97,35.97 17.37,36.38 18.76,36.38 CN16.4 20.94,36.62 21.84,37.52 D54.2 D54.9 23.64,37.52 23.69,37.57 24.15,37.57 24.2,37.52 25.7,37.52 25.75,37.56
  Inner2 w0.203: v1(43.73,44.99) 36.21,44.99 34.52,43.3 34.52,43.27 28.77,37.52 v1(25.79,37.52) ; v1(48.81,13.22) 48.81,11.84 50.08,10.57 50.08,6.51 48.18,4.6 12.06,4.6 6.3,10.36 6.3,10.41 4.74,11.97 4.74,18.06 6.52,19.84 9.69,19.84 12.62,22.76 12.62,33.05 v1(12.11,33.56)
RADIO_F8: length 49.4
  Top Layer w0.203: CN18.3 v1(36.11,7.52) ; v1(45.25,38.25) 45.25,45.89 45.64,46.27 45.64,47.84
  Inner2 w0.203: v1(45.25,38.25) 45.13,38.25 45.13,38.26 44.11,38.26 33.06,27.21 33.06,10.57 v1(36.11,7.52)
RADIO_F9: length 54
  Top Layer w0.203: v1(46.27,37.12) 46.27,49.69 45.64,50.32 45.64,52.04 ; CN18.5 v1(38.65,7.52)
  Inner2 w0.203: v1(38.65,7.52) 37.38,8.79 37.38,13.36 34.71,16.03 34.71,26.95 43.86,36.1 45.25,36.1 v1(46.27,37.12)
RADIO_F10: length 56.4
  Top Layer w0.203: CN17.23 46.91,43.84 46.99,43.76 46.99,43.74 47.16,43.57 v1(47.16,39.52)
  Inner2 w0.203: LED1.5 15.95,16.83 28.11,28.98 33.19,28.98 43.73,39.52 v1(47.16,39.52)
RADIO_F11: length 65.1
  Top Layer w0.203: U14.B2 72.67,5.25 v1(73.19,4.73) ; v1(47.54,44.74) 47.54,49.67 46.91,50.31 CN17.24
  Inner2 w0.203: v1(47.54,44.74) 55.28,44.74 67.35,32.67 67.35,14.89 68.75,13.49 68.75,6.38 70.4,4.73 v1(73.19,4.73)
RADIO_F12: length 56.3
  Top Layer w0.203: CN17.25 48.18,45.62 48.18,45.61 R91.1 v1(49.32,43.13)
  Inner2 w0.203: SW9.1 5.96,40.36 8.73,43.13 29.93,43.13 34.08,47.27 43.22,47.27 47.37,43.13 v1(49.32,43.13)
RADIO_F13: length 58.7
  Top Layer w0.203: CN17.26 v1(48.18,50.33) ; v1(69.64,7.07) 69.64,6.23 R102.1 R103.2
  Inner2 w0.203: v1(48.18,50.33) 51.48,47.02 55.67,47.02 68.24,34.45 68.24,15.78 69.64,14.38 v1(69.64,7.07)
RADIO_F19: length 43.6
  Top Layer w0.203: CN16.9 15.78,32.81 16.62,31.96 21.03,31.96 21.65,32.59 D69.5 D69.6 23.57,32.59 24.08,32.08 v1(26.29,32.08) ; R94.2 52.12,40.55 v1(52.11,40.54)
  Inner2 w0.203: v1(52.11,40.54) 43.35,40.54 33.82,31.02 27.36,31.02 v1(26.29,32.08)
RADIO_F20: length 39.9
  Top Layer w0.203: CN16.10 20.55,32.81 20.83,33.09 D69.4 D69.7 23.73,33.09 23.86,32.96 v1(27.44,32.96) ; v1(54.27,41.56) 53.45,41.56 R95.1
  Inner2 w0.203: v1(54.27,41.56) 42.84,41.56 34.26,32.98 27.45,32.98 v1(27.44,32.96)
STAT: length 79.1
  Top Layer w0.203: LED1.2 v1(3.54,9.05) ; v1(57.83,1.93) 59.86,3.97 67.06,3.97 68.11,5.02 68.11,8.03 R100.2
  Inner2 w0.203: v1(3.54,9.05) 10.66,1.93 v1(57.83,1.93)
TX_BUF: length 1.2
  Top Layer w0.203: U8.2 70.29,53.71 R6.2
WSTK_P1: length 18
  Top Layer w0.203: 36.11,11 v1(36.11,13.22) ; v1(33.95,26.19) 33.95,27.78 CN2.4
  Inner2 w0.203: v1(36.11,13.22) 33.95,15.38 v1(33.95,26.19)
WSTK_P3: length 18.5
  Top Layer w0.203: CN2.6 35.35,27.91 v1(35.35,25.81) ; 38.65,11 v1(38.65,13.22)
  Inner2 w0.203: v1(35.35,25.81) 35.35,17.05 38.65,13.74 v1(38.65,13.22)
WSTK_P4: length 20.8
  Top Layer w0.203: CN2.7 36.87,23.71 v1(36.87,21.49) ; CN18.7 v1(41.19,7.52)
  Inner2 w0.203: v1(41.19,7.52) 41.95,8.28 41.95,14.25 36.87,19.33 v1(36.87,21.49)
WSTK_P5: length 19.4
  Top Layer w0.203: 41.19,11 v1(41.19,13.22) ; CN2.8 v1(36.75,26.19)
  Inner2 w0.203: v1(41.19,13.22) 36.11,18.3 36.11,25.56 v1(36.75,26.19)
WSTK_P6: length 20.8
  Top Layer w0.203: CN18.9 v1(43.73,7.52) ; 38.02,23.84 37.89,23.71 v1(37.89,22.13)
  Inner2 w0.203: v1(37.89,22.13) 37.89,19.97 42.84,15.02 42.84,8.41 v1(43.73,7.52)
WSTK_P7: length 19.4
  Top Layer w0.203: 43.73,11 v1(43.73,13.22) ; 38.02,28.04 v1(38.02,26.19)
  Inner2 w0.203: v1(38.02,26.19) 38.21,25.99 38.21,25.96 38.52,25.65 38.52,20.86 43.73,15.65 v1(43.73,13.22)
WSTK_P8: length 21.2
  Top Layer w0.203: CN2.11 v1(39.28,21.62) ; CN18.11 v1(46.27,7.52)
  Inner2 w0.203: v1(46.27,7.52) 46.04,7.75 46.04,7.75 45.72,8.08 45.71,8.08 45.38,8.41 45.38,15.52 v1(39.28,21.62)
WSTK_P10: length 21.7
  Top Layer w0.203: CN2.13 v1(40.56,22.13) ; CN18.13 v1(48.81,7.52)
  Inner2 w0.203: v1(40.56,22.13) 47.54,15.14 47.54,11.2 48.81,9.93 v1(48.81,7.52)
WSTK_P12: length 22.2
  Top Layer w0.203: CN18.15 v1(51.35,7.52) ; CN2.15 42.08,23.58 v1(42.08,22.13)
  Inner2 w0.203: v1(51.35,7.52) 51.35,10.95 49.95,12.35 49.95,14.25 v1(42.08,22.13)
WSTK_P13: length 21
  Top Layer w0.203: CN2.16 v1(41.83,26.19) ; 51.35,11 v1(51.35,13.22)
  Inner2 w0.203: v1(41.83,26.19) 51.35,16.67 v1(51.35,13.22)
WSTK_P41: length 36.1
  Top Layer w0.203: CN17.8 36.49,51.78 v1(36.49,50.33) ; v1(67.99,53.75) 69.38,53.75 R7.2
  Inner2 w0.203: v1(67.99,53.75) 67.22,52.99 39.15,52.99 v1(36.49,50.33)
WSTK_P43: length 55.7
  Top Layer w0.203: 38.02,52.04 v1(38.02,50.33) ; R3.2 v1(21.59,45.14) ; R6.1 v1(70.27,51.97)
  Inner2 w0.203: v1(70.27,51.97) 70.02,51.72 39.41,51.72 v1(38.02,50.33) 36.36,48.67 33.32,48.67 29.78,45.14 v1(21.59,45.14)
$2N1273: length 2.6
  Top Layer w0.203: 73.78,52.76 73.78,51.92 R93.2
$2N1277: length 3.3
  Top Layer w0.203: CN3.5 NOREF#11.1 L1.1
$2N4382: length 2.6
  Top Layer w0.203: 64.66,7.98 Q5.7 ; 64.66,7.98 64.58,8.05 Q5.3 ; 64.66,7.98 62.98,7.98
$2N6105: length 5.9
  Top Layer w0.203: SW9.2 7.4,34.75 R89.1
$2N12487: length 1.7
  Top Layer w0.203: L1.2 72.57,48.67 R93.1
$2N12552: length 3
  Top Layer w0.203: L3.1 16.34,58.43 NOREF#12.2 CN1.5
$2N12590: length 1.5
  Top Layer w0.203: L4.2 17.72,47.09 R1.1
$2N12593: length 2.9
  Top Layer w0.203: L4.1 16.19,48.43 NOREF#3.1 CN1.4
$2N15515: length 14.4
  Top Layer w0.203: CN1.6 CN1.7 0.87,42.14 C34.2
$2N15542: length 3.5
  Top Layer w0.203: CN3.4 NOREF#4.2 74.72,60.34 L2.1
$2N15546: length 1.7
  Top Layer w0.203: R92.1 72.57,58.71 L2.2
$2N15633: length 4.5
  Top Layer w0.762: C35.2 15.39,53.43 CN1.2
$2N30226: length 9.5
  Top Layer w0.203: R94.1 52.12,44.13 51.34,44.91 51.34,49.67 51.99,50.32 CN17.32
$2N30268: length 4.8
  Top Layer w0.203: R95.2 53.39,47.7 CN17.33
$2N74431: length 3
  Top Layer w0.203: 82.28,38.9 82,38.63 USB1.A5
$2N74433: length 2.9
  Top Layer w0.203: 80.88,38.9 81,38.78 USB1.B5
$2N74739: length 4.6
  Top Layer w0.508: 76.26,15.85 76.45,16.05 Q9.3
$2N75619: length 1.2
  Top Layer w0.61: R101.1 70.78,14.8 U13.5
$2N75635: length 1.2
  Top Layer w0.305: R100.1 70.7,11.02 U13.1
$2N78282: length 1.4
  Top Layer w0.203: U14.A1 71.78,6.18 R102.2
$2N80640: length 5.9
  Top Layer w0.203: SW8.2 7.4,24.75 R59.1
$2N85855: length 2.2
  Top Layer w0.203: LED1.6 8.59,14.26 R110.2
$2N85859: length 2.2
  Top Layer w0.203: R109.2 6.05,14.26 LED1.4
$2N118115: length 1.9
  Top Layer w0.203: U21.5 R3.1
$2N118330: length 2.5
  Top Layer w0.203: U22.4 67.94,14.81 68.33,15.2
$2N118335: length 2.6
  Top Layer w0.203: U22.2 67.71,13.81 68.33,13.2
$2N118624: length 5.7
  Top Layer w0.203: C47.1 R111.1 ; R111.1 60.97,14.72 U17.2 ; R111.1 61.56,15.31 U22.6 U22.7 U22.8

## Copper pours and planes (outline as drawn; the poured copper is in the pictures)
+3.3V_EFR on Top Layer: 64.28,8.38 66.99,8.38 66.99,4.72 64.28,4.72
+3V3_BUCK_BOOST on Top Layer: 65.4,10.19 66.98,10.19 66.98,8.55 65.4,8.55
+3V3_BUCK_BOOST on Top Layer: 65.21,13.45 66.98,13.45 66.98,9.78 65.21,9.78
+8.3V on Top Layer: 81.96,15.4 85.77,15.4 85.77,9.55 81.96,9.55
+VBAT on Top Layer: 67.8,17.74 69.97,17.74 69.97,16.1 67.8,16.1
+VBAT on Inner2: 68.62,17.55 70,17.55 70,16.44 68.62,16.44
+VCC on Top Layer: 65.55,22.07 67.03,22.07 67.03,20.64 65.55,20.64
+VCC1 on Top Layer: 64.05,22.05 66.46,22.05 66.46,15.14 64.05,15.14
GND on Top Layer: 61.98,19.63 64.99,19.63 64.99,8.86 61.98,8.86
GND on Bottom Layer: -0.09,71.69 93.91,71.69 93.91,-1.31 -0.09,-1.31
GND on Inner1: -0.09,71.69 93.91,71.69 93.91,-1.31 -0.09,-1.31
$2N15515 on Top Layer: 0.42,58.45 2.07,58.45 2.07,40.8 0.42,40.8
$2N118330 on Top Layer: 65.5,15.85 69.24,15.85 69.24,14.6 65.5,14.6
$2N118335 on Top Layer: 65.51,14 69.23,14 69.23,12.5 65.51,12.5

## Text on the board
Bottom Silkscreen Layer: BATT+ | BATT-
Document Layer: ANTENNA
Top Silkscreen Layer: INPUT:+9VDC | JLCJLCJLCJLC | USER | POWER | CHARG | RESET | MINI | ON | OFF | OHPP-003C-MIDI Cable Replacement | OUT | IN
